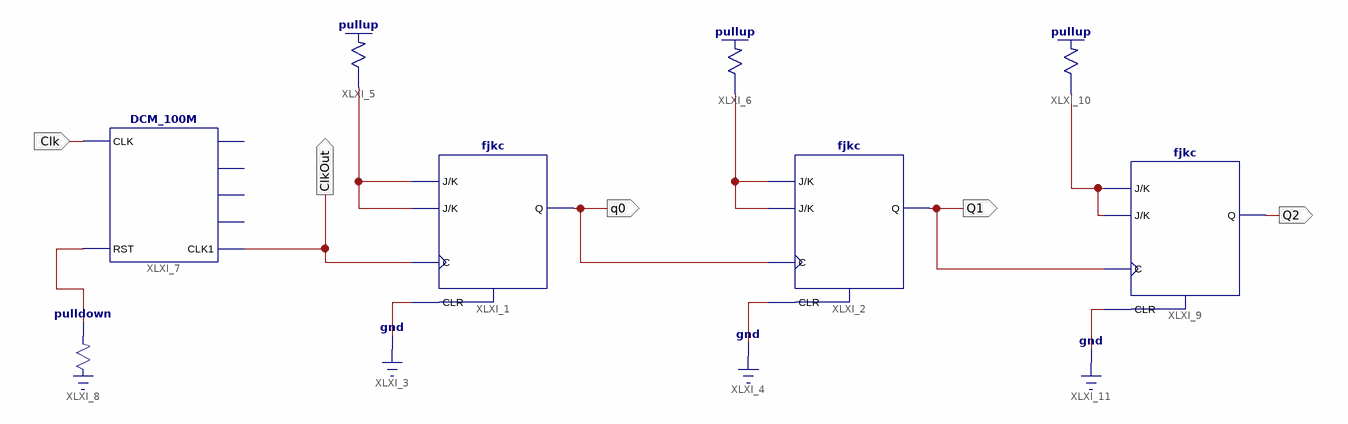
[diagram p0: schematic sheet 1]
// Xilinx ISE schematic Exp2JKRippleCounter.sch (spartan3e) as structural Verilog: 8 symbols, 5 ports
module Exp2JKRippleCounter (
  input  Clk,
  output q0,
  output Q1,
  output ClkOut,
  output Q2
);

  wire XLXN_3, XLXN_4, XLXN_10, XLXN_12;

  fjkc XLXI_1 (.C(ClkOut), .CLR(1'b0), .J(XLXN_3), .K(XLXN_3), .Q(q0));
  fjkc XLXI_2 (.C(q0), .CLR(1'b0), .J(XLXN_4), .K(XLXN_4), .Q(Q1));
  \pullup  XLXI_5 (.O(XLXN_3));
  \pullup  XLXI_6 (.O(XLXN_4));
  DCM_100M XLXI_7 (.CLK(Clk), .RST(XLXN_10), .CLK1(ClkOut));  // open: CLK1M, CLK10k, CLK1k, CLK100
  \pulldown  XLXI_8 (.O(XLXN_10));
  fjkc XLXI_9 (.C(Q1), .CLR(1'b0), .J(XLXN_12), .K(XLXN_12), .Q(Q2));
  \pullup  XLXI_10 (.O(XLXN_12));
endmodule
